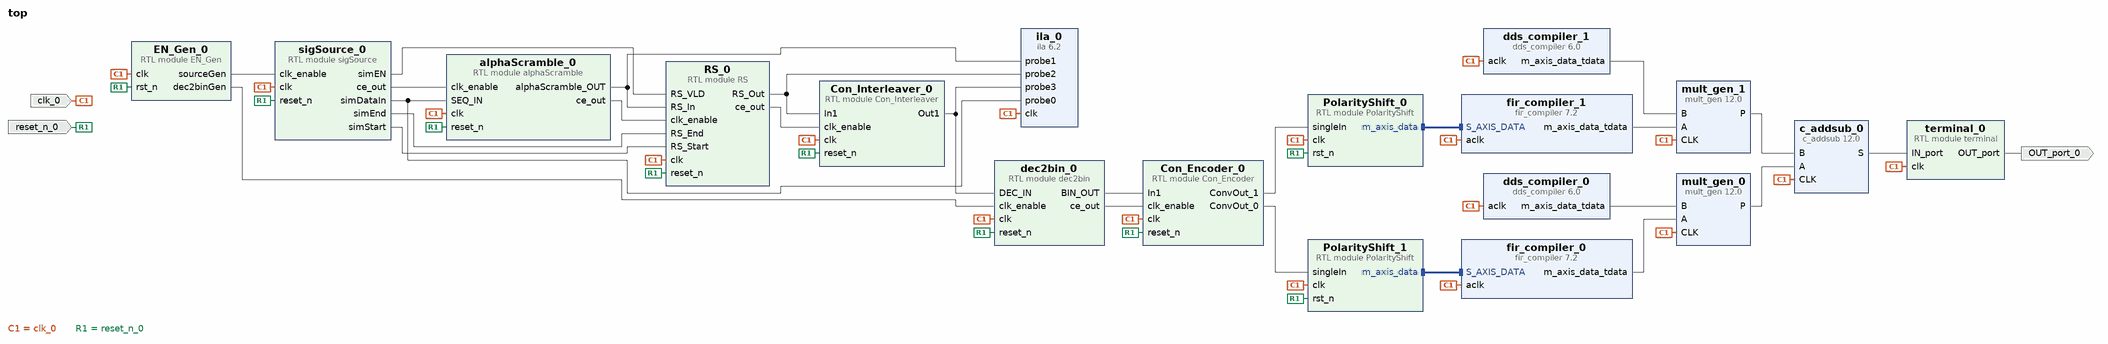
[diagram p0: block diagram of the top level]
# Vivado block design top, xc7z020clg400-2, Vivado 2023.2
create_bd_design top

create_bd_port -dir I -type clk clk_0
set_property -dict {CONFIG.FREQ_HZ 200000000} [get_bd_ports clk_0]
create_bd_port -dir I -type rst reset_n_0
create_bd_port -dir O OUT_port_0

create_bd_cell -type module -reference alphaScramble alphaScramble_0
create_bd_cell -type module -reference RS RS_0
create_bd_cell -type module -reference sigSource sigSource_0
create_bd_cell -type module -reference Con_Interleaver Con_Interleaver_0
create_bd_cell -type module -reference dec2bin dec2bin_0
create_bd_cell -type module -reference Con_Encoder Con_Encoder_0
create_bd_cell -type module -reference PolarityShift PolarityShift_0
create_bd_cell -type module -reference PolarityShift PolarityShift_1
create_bd_cell -type ip -vlnv xilinx.com:ip:dds_compiler:6.0 dds_compiler_0
set_property -dict [list \
  CONFIG.DDS_Clock_Rate 200 \
  CONFIG.Frequency_Resolution 0.4 \
  CONFIG.Has_Phase_Out false \
  CONFIG.Latency 8 \
  CONFIG.M_DATA_Has_TUSER Not_Required \
  CONFIG.Noise_Shaping Auto \
  CONFIG.Output_Frequency1 50 \
  CONFIG.Output_Selection Cosine \
  CONFIG.Output_Width 14 \
  CONFIG.PINC1 1000000000000000000000000000 \
  CONFIG.Phase_Width 29 \
  CONFIG.Spurious_Free_Dynamic_Range 80 \
] [get_bd_cells dds_compiler_0]
create_bd_cell -type ip -vlnv xilinx.com:ip:dds_compiler:6.0 dds_compiler_1
set_property -dict [list \
  CONFIG.DDS_Clock_Rate 200 \
  CONFIG.Frequency_Resolution 0.4 \
  CONFIG.Has_Phase_Out false \
  CONFIG.Latency 8 \
  CONFIG.M_DATA_Has_TUSER Not_Required \
  CONFIG.Noise_Shaping Auto \
  CONFIG.Output_Frequency1 50 \
  CONFIG.Output_Selection Sine \
  CONFIG.Output_Width 14 \
  CONFIG.PINC1 1000000000000000000000000000 \
  CONFIG.Phase_Width 29 \
  CONFIG.Spurious_Free_Dynamic_Range 80 \
] [get_bd_cells dds_compiler_1]
create_bd_cell -type ip -vlnv xilinx.com:ip:mult_gen:12.0 mult_gen_0
set_property -dict [list \
  CONFIG.MultType Parallel_Multiplier \
  CONFIG.Multiplier_Construction Use_LUTs \
  CONFIG.OptGoal Speed \
  CONFIG.OutputWidthHigh 40 \
  CONFIG.PipeStages 4 \
  CONFIG.PortAType Signed \
  CONFIG.PortAWidth 24 \
  CONFIG.PortBType Signed \
  CONFIG.PortBWidth 16 \
  CONFIG.Use_Custom_Output_Width true \
] [get_bd_cells mult_gen_0]
create_bd_cell -type ip -vlnv xilinx.com:ip:c_addsub:12.0 c_addsub_0
set_property -dict [list \
  CONFIG.A_Width 41 \
  CONFIG.B_Constant false \
  CONFIG.B_Value 00000000000000000000000000000000000000000 \
  CONFIG.B_Width 41 \
  CONFIG.CE false \
  CONFIG.Implementation Fabric \
  CONFIG.Latency 4 \
  CONFIG.Latency_Configuration Automatic \
  CONFIG.Out_Width 42 \
] [get_bd_cells c_addsub_0]
create_bd_cell -type module -reference EN_Gen EN_Gen_0
create_bd_cell -type ip -vlnv xilinx.com:ip:fir_compiler:7.2 fir_compiler_0
set_property -dict [list \
  CONFIG.Clock_Frequency 200 \
  CONFIG.CoefficientSource COE_File \
  CONFIG.Coefficient_Buffer_Type Block \
  CONFIG.Coefficient_Fanout false \
  CONFIG.Coefficient_File ../../../../../../../matlab/rcos.coe \
  CONFIG.Coefficient_Fractional_Bits 0 \
  CONFIG.Coefficient_Sets 1 \
  CONFIG.Coefficient_Sign Signed \
  CONFIG.Coefficient_Structure Inferred \
  CONFIG.Coefficient_Width 16 \
  CONFIG.ColumnConfig 0,0,41 \
  CONFIG.Control_Broadcast_Fanout false \
  CONFIG.Control_Column_Fanout false \
  CONFIG.Control_LUT_Pipeline false \
  CONFIG.Control_Path_Fanout false \
  CONFIG.Data_Path_Broadcast false \
  CONFIG.Data_Path_Fanout false \
  CONFIG.Data_Sign Signed \
  CONFIG.Data_Width 2 \
  CONFIG.Disable_Half_Band_Centre_Tap false \
  CONFIG.Filter_Architecture Systolic_Multiply_Accumulate \
  CONFIG.Inter_Column_Pipe_Length 6 \
  CONFIG.Multi_Column_Support Automatic \
  CONFIG.No_BRAM_Read_First_Mode false \
  CONFIG.No_SRL_Attributes false \
  CONFIG.Optimal_Column_Lengths false \
  CONFIG.Optimization_Goal Area \
  CONFIG.Optimization_List None \
  CONFIG.Optimization_Selection None \
  CONFIG.Other false \
  CONFIG.Output_Buffer_Type Block \
  CONFIG.Output_Rounding_Mode Truncate_LSBs \
  CONFIG.Output_Width 20 \
  CONFIG.Pre_Adder_Pipeline false \
  CONFIG.Quantization Integer_Coefficients \
  CONFIG.S_DATA_Has_FIFO false \
  CONFIG.Sample_Frequency 200 \
] [get_bd_cells fir_compiler_0]
create_bd_cell -type ip -vlnv xilinx.com:ip:fir_compiler:7.2 fir_compiler_1
set_property -dict [list \
  CONFIG.Clock_Frequency 200 \
  CONFIG.CoefficientSource COE_File \
  CONFIG.Coefficient_Fanout false \
  CONFIG.Coefficient_File ../../../../../../../matlab/rcos.coe \
  CONFIG.Coefficient_Fractional_Bits 0 \
  CONFIG.Coefficient_Sets 1 \
  CONFIG.Coefficient_Sign Signed \
  CONFIG.Coefficient_Structure Inferred \
  CONFIG.Coefficient_Width 16 \
  CONFIG.ColumnConfig 0,0,41 \
  CONFIG.Control_Broadcast_Fanout false \
  CONFIG.Control_Column_Fanout false \
  CONFIG.Control_LUT_Pipeline false \
  CONFIG.Control_Path_Fanout false \
  CONFIG.Data_Path_Broadcast false \
  CONFIG.Data_Path_Fanout false \
  CONFIG.Data_Sign Signed \
  CONFIG.Data_Width 2 \
  CONFIG.Disable_Half_Band_Centre_Tap false \
  CONFIG.Filter_Architecture Systolic_Multiply_Accumulate \
  CONFIG.Inter_Column_Pipe_Length 6 \
  CONFIG.No_BRAM_Read_First_Mode false \
  CONFIG.No_SRL_Attributes false \
  CONFIG.Optimal_Column_Lengths false \
  CONFIG.Optimization_Goal Area \
  CONFIG.Optimization_List None \
  CONFIG.Optimization_Selection None \
  CONFIG.Other false \
  CONFIG.Output_Rounding_Mode Truncate_LSBs \
  CONFIG.Output_Width 20 \
  CONFIG.Pre_Adder_Pipeline false \
  CONFIG.Quantization Integer_Coefficients \
  CONFIG.S_DATA_Has_FIFO false \
  CONFIG.Sample_Frequency 200 \
] [get_bd_cells fir_compiler_1]
create_bd_cell -type ip -vlnv xilinx.com:ip:mult_gen:12.0 mult_gen_1
set_property -dict [list \
  CONFIG.MultType Parallel_Multiplier \
  CONFIG.Multiplier_Construction Use_LUTs \
  CONFIG.OptGoal Speed \
  CONFIG.OutputWidthHigh 40 \
  CONFIG.PipeStages 4 \
  CONFIG.PortAType Signed \
  CONFIG.PortAWidth 24 \
  CONFIG.PortBType Signed \
  CONFIG.PortBWidth 16 \
  CONFIG.Use_Custom_Output_Width true \
] [get_bd_cells mult_gen_1]
create_bd_cell -type module -reference terminal terminal_0
create_bd_cell -type ip -vlnv xilinx.com:ip:ila:6.2 ila_0
set_property -dict [list \
  CONFIG.ALL_PROBE_SAME_MU_CNT 1 \
  CONFIG.C_DATA_DEPTH 8192 \
  CONFIG.C_INPUT_PIPE_STAGES 2 \
  CONFIG.C_MONITOR_TYPE Native \
  CONFIG.C_NUM_OF_PROBES 4 \
  CONFIG.C_PROBE0_WIDTH 8 \
  CONFIG.C_PROBE1_WIDTH 8 \
  CONFIG.C_PROBE2_WIDTH 8 \
  CONFIG.C_PROBE3_WIDTH 8 \
] [get_bd_cells ila_0]

# ---- connections ----

connect_bd_intf_net -intf_net PolarityShift_0_m_axis [get_bd_intf_pins fir_compiler_1/S_AXIS_DATA] [get_bd_intf_pins PolarityShift_0/m_axis_data]
connect_bd_intf_net [get_bd_intf_pins PolarityShift_1/m_axis_data] [get_bd_intf_pins fir_compiler_0/S_AXIS_DATA]
connect_bd_net [get_bd_pins Con_Encoder_0/ConvOut_0] [get_bd_pins PolarityShift_1/singleIn]
connect_bd_net [get_bd_pins Con_Encoder_0/ConvOut_1] [get_bd_pins PolarityShift_0/singleIn]
connect_bd_net [get_bd_pins Con_Interleaver_0/Out1] [get_bd_pins dec2bin_0/DEC_IN] [get_bd_pins ila_0/probe3]
connect_bd_net [get_bd_pins EN_Gen_0/dec2binGen] [get_bd_pins dec2bin_0/clk_enable]
connect_bd_net [get_bd_pins EN_Gen_0/sourceGen] [get_bd_pins sigSource_0/clk_enable]
connect_bd_net [get_bd_pins RS_0/RS_Out] [get_bd_pins Con_Interleaver_0/In1] [get_bd_pins ila_0/probe2]
connect_bd_net [get_bd_pins RS_0/ce_out] [get_bd_pins Con_Interleaver_0/clk_enable]
connect_bd_net [get_bd_pins alphaScramble_0/alphaScramble_OUT] [get_bd_pins RS_0/RS_In] [get_bd_pins ila_0/probe1]
connect_bd_net [get_bd_pins alphaScramble_0/ce_out] [get_bd_pins RS_0/clk_enable]
connect_bd_net [get_bd_pins c_addsub_0/S] [get_bd_pins terminal_0/IN_port]
connect_bd_net -net clk_0_1 [get_bd_ports clk_0] \
  [get_bd_pins dds_compiler_0/aclk] [get_bd_pins dds_compiler_1/aclk] [get_bd_pins mult_gen_0/CLK] \
  [get_bd_pins c_addsub_0/CLK] [get_bd_pins fir_compiler_0/aclk] [get_bd_pins alphaScramble_0/clk] [get_bd_pins RS_0/clk] \
  [get_bd_pins sigSource_0/clk] [get_bd_pins Con_Interleaver_0/clk] [get_bd_pins dec2bin_0/clk] \
  [get_bd_pins Con_Encoder_0/clk] [get_bd_pins EN_Gen_0/clk] [get_bd_pins fir_compiler_1/aclk] [get_bd_pins mult_gen_1/CLK] \
  [get_bd_pins terminal_0/clk] [get_bd_pins PolarityShift_0/clk] [get_bd_pins PolarityShift_1/clk] [get_bd_pins ila_0/clk]
connect_bd_net [get_bd_pins dds_compiler_0/m_axis_data_tdata] [get_bd_pins mult_gen_0/B]
connect_bd_net [get_bd_pins dds_compiler_1/m_axis_data_tdata] [get_bd_pins mult_gen_1/B]
connect_bd_net [get_bd_pins dec2bin_0/BIN_OUT] [get_bd_pins Con_Encoder_0/In1]
connect_bd_net [get_bd_pins dec2bin_0/ce_out] [get_bd_pins Con_Encoder_0/clk_enable]
connect_bd_net [get_bd_pins fir_compiler_0/m_axis_data_tdata] [get_bd_pins mult_gen_0/A]
connect_bd_net [get_bd_pins fir_compiler_1/m_axis_data_tdata] [get_bd_pins mult_gen_1/A]
connect_bd_net [get_bd_pins mult_gen_0/P] [get_bd_pins c_addsub_0/A]
connect_bd_net [get_bd_pins mult_gen_1/P] [get_bd_pins c_addsub_0/B]
connect_bd_net -net reset_n_0_1 [get_bd_ports reset_n_0] \
  [get_bd_pins alphaScramble_0/reset_n] [get_bd_pins RS_0/reset_n] [get_bd_pins sigSource_0/reset_n] \
  [get_bd_pins Con_Interleaver_0/reset_n] [get_bd_pins dec2bin_0/reset_n] [get_bd_pins Con_Encoder_0/reset_n] \
  [get_bd_pins EN_Gen_0/rst_n] [get_bd_pins PolarityShift_0/rst_n] [get_bd_pins PolarityShift_1/rst_n]
connect_bd_net [get_bd_pins sigSource_0/ce_out] [get_bd_pins alphaScramble_0/clk_enable]
connect_bd_net [get_bd_pins sigSource_0/simDataIn] [get_bd_pins alphaScramble_0/SEQ_IN] [get_bd_pins ila_0/probe0]
connect_bd_net [get_bd_pins sigSource_0/simEN] [get_bd_pins RS_0/RS_VLD]
connect_bd_net [get_bd_pins sigSource_0/simEnd] [get_bd_pins RS_0/RS_End]
connect_bd_net [get_bd_pins sigSource_0/simStart] [get_bd_pins RS_0/RS_Start]
connect_bd_net [get_bd_pins terminal_0/OUT_port] [get_bd_ports OUT_port_0]

validate_bd_design
save_bd_design
